# EAGLE design V-00735-00 (EAGLE 7.2.0)

## Sheet 1 of 2
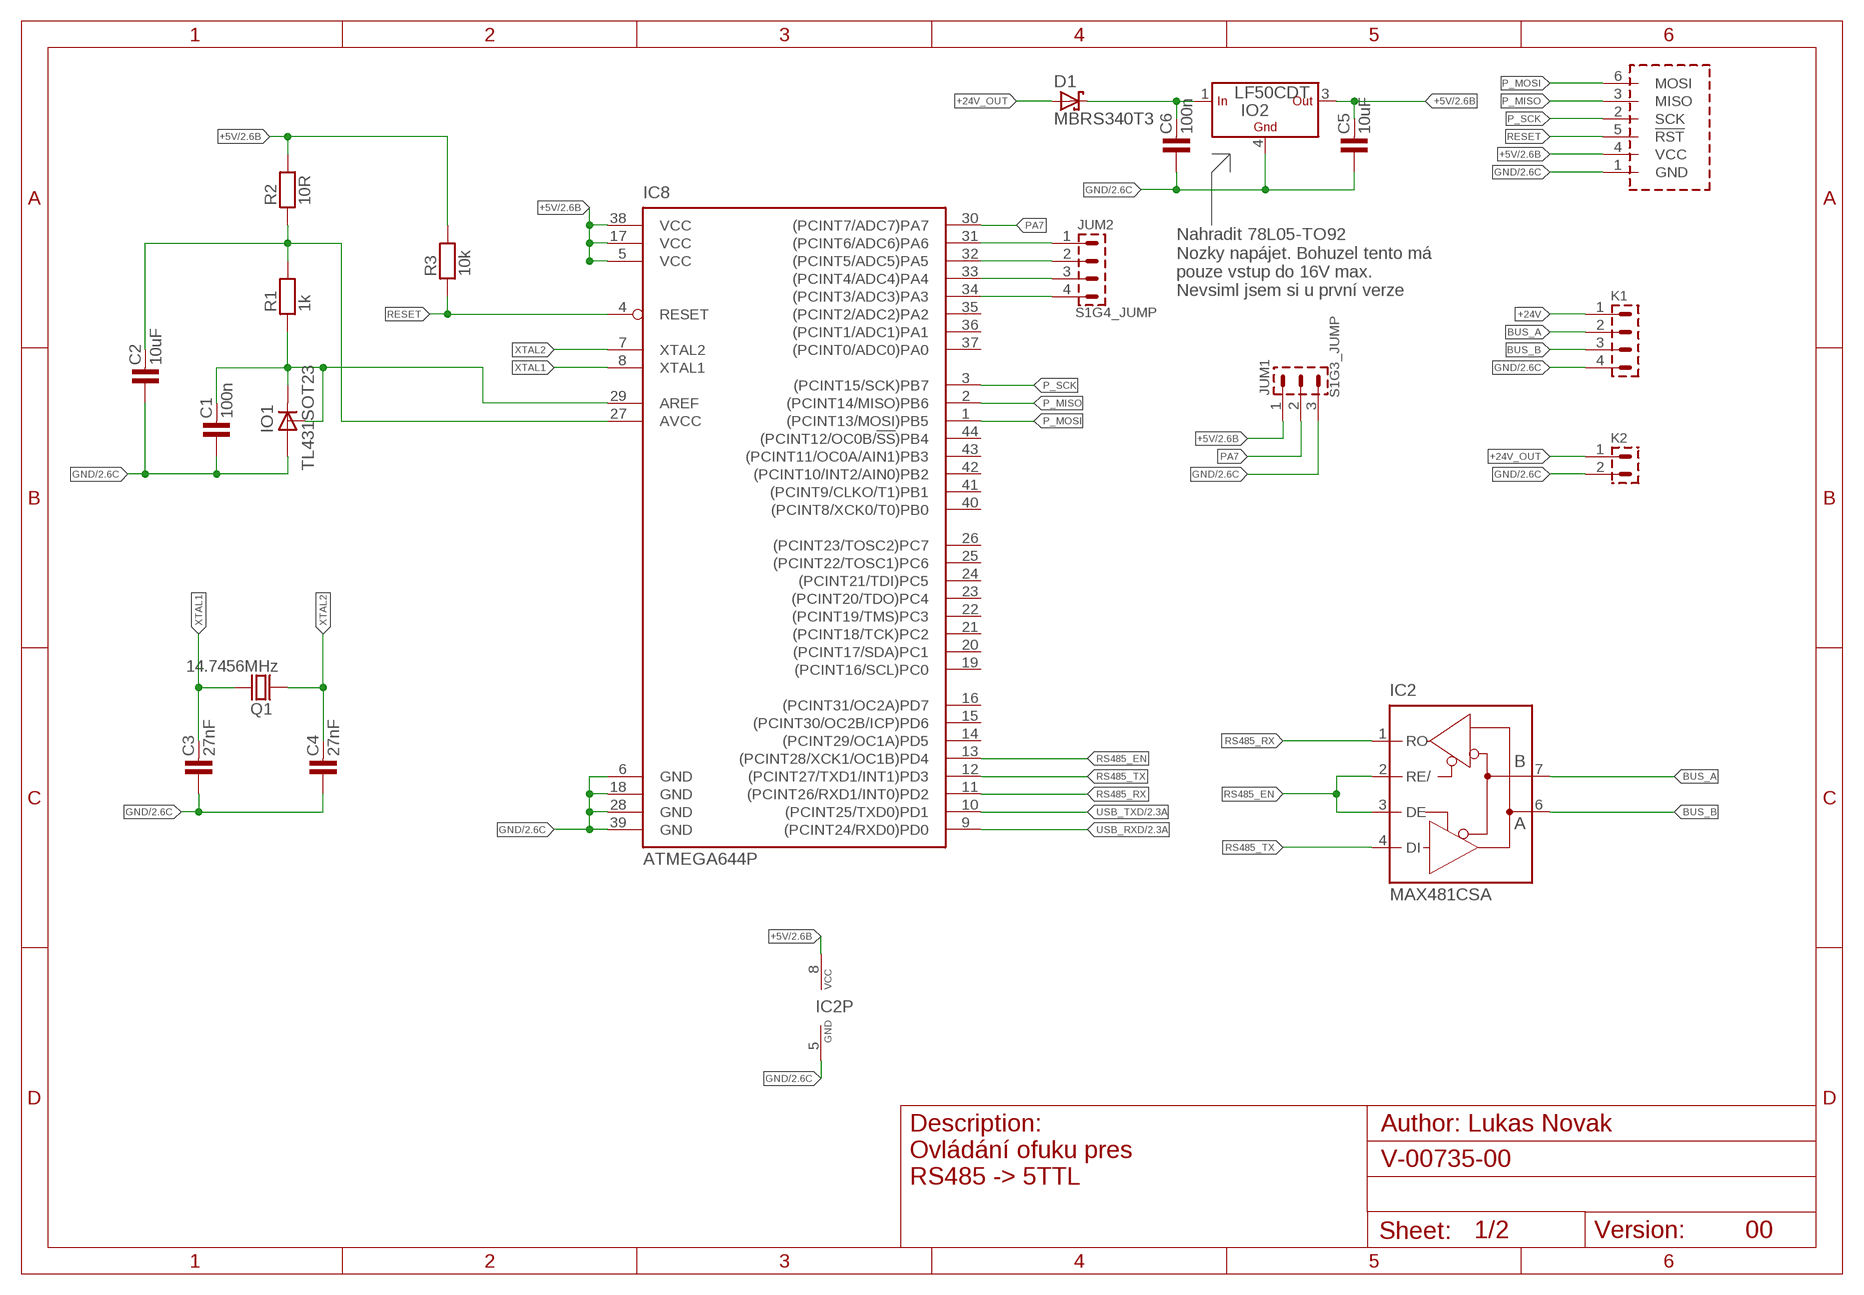
[diagram p0: schematic, sheet 1]

### Parts
C1  100n  C-KER_1206  [1206]
C2  10uF  C-KER_1206  [1206]
C3  27nF  C-KER_0805  [0805]
C4  27nF  C-KER_0805  [0805]
C5  10uF  C-KER_1206  [1206]
C6  100n  C-KER_1206  [1206]
D1  MBRS340T3  [SMC]
IC2  MAX481CSA  [SO08]
IC8  ATMEGA644P  [TQFP44]
IO1  TL431SOT23  [SOT23]
IO2  LF50CDT  LF_CDT  [DPAK]
JUM1  S1G3_JUMP  [S1G3_JUM]
JUM2  S1G4_JUMP  [S1G4_JUM]
K1  PSH02-04P  [PSH02-04P]
K2  PSH02-02P  [PSH02-02P]
Q1  14.7456MHz  Q_HC-49U  [HC-49U]
R1  1k  R_1206  [1206]
R2  10R  R_1206  [1206]
R3  10k  R_1206  [1206]
U$1  AVR_PROG_SPI  [PSH02-06P]

### Nets
+5V: C5.2 IC2.8(VCC) IC8.5(VCC) IC8.17(VCC) IC8.38(VCC) IO2.3(OUT) JUM1.1 R2.2 R3.2 U$1.4(VCC) ; also sheet 2
+24V: C6.2 D1.C IO2.1(IN) K1.1
+24V_OUT: D1.A K2.1
AREF: C1.2 IC8.29(AREF) IO1.1(C) IO1.2(R) R1.1
AVCC: C2.2 IC8.27(AVCC) R1.2 R2.1
BUS_A: IC2.7(B) K1.2
BUS_B: IC2.6(A) K1.3
GND: C1.1 C2.1 C3.1 C4.1 C5.1 C6.1 IC2.5(GND) IC8.6(GND) IC8.18(GND) IC8.28(GND) IC8.39(GND) IO1.3(A) IO2.4(GND) JUM1.3 K1.4 K2.2 U$1.1(GND) ; also sheet 2
N$1: IC8.31((PCINT6/ADC6)PA6) JUM2.1
N$2: IC8.32((PCINT5/ADC5)PA5) JUM2.2
N$5: IC8.33((PCINT4/ADC4)PA4) JUM2.3
N$6: IC8.34((PCINT3/ADC3)PA3) JUM2.4
P_MISO: IC8.2((PCINT14/MISO)PB6) U$1.3(MISO)
P_MOSI: IC8.1((PCINT13/MOSI)PB5) U$1.6(MOSI)
P_SCK: IC8.3((PCINT15/SCK)PB7) U$1.2(SCK)
PA7: IC8.30((PCINT7/ADC7)PA7) JUM1.2
RESET: IC8.4(RESET) R3.1 U$1.5(!RST)
RS485_EN: IC2.2(RE/) IC2.3(DE) IC8.13((PCINT28/XCK1/OC1B)PD4)
RS485_RX: IC2.1(RO) IC8.11((PCINT26/RXD1/INT0)PD2)
RS485_TX: IC2.4(DI) IC8.12((PCINT27/TXD1/INT1)PD3)
USB_RXD: IC8.9((PCINT24/RXD0)PD0) ; also sheet 2
USB_TXD: IC8.10((PCINT25/TXD0)PD1) ; also sheet 2
XTAL1: C3.2 IC8.8(XTAL1) Q1.2
XTAL2: C4.2 IC8.7(XTAL2) Q1.1
Unconnected: IC8.14((PCINT29/OC1A)PD5) IC8.15((PCINT30/OC2B/ICP)PD6) IC8.16((PCINT31/OC2A)PD7) IC8.19((PCINT16/SCL)PC0) IC8.20((PCINT17/SDA)PC1) IC8.21((PCINT18/TCK)PC2) IC8.22((PCINT19/TMS)PC3) IC8.23((PCINT20/TDO)PC4) IC8.24((PCINT21/TDI)PC5) IC8.25((PCINT22/TOSC1)PC6) IC8.26((PCINT23/TOSC2)PC7) IC8.35((PCINT2/ADC2)PA2) IC8.36((PCINT1/ADC1)PA1) IC8.37((PCINT0/ADC0)PA0) IC8.40((PCINT8/XCK0/T0)PB0) IC8.41((PCINT9/CLKO/T1)PB1) IC8.42((PCINT10/INT2/AIN0)PB2) IC8.43((PCINT11/OC0A/AIN1)PB3) IC8.44((PCINT12/OC0B/!SS!)PB4)

### Notes on the sheet
- Nahradit 78L05-TO92
  Nozky napájet. Bohuzel tento má
  pouze vstup do 16V max.
  Nevsiml jsem si u první verze
- Ovládání ofuku pres
  RS485 -> 5TTL
- 00

## Sheet 2 of 2
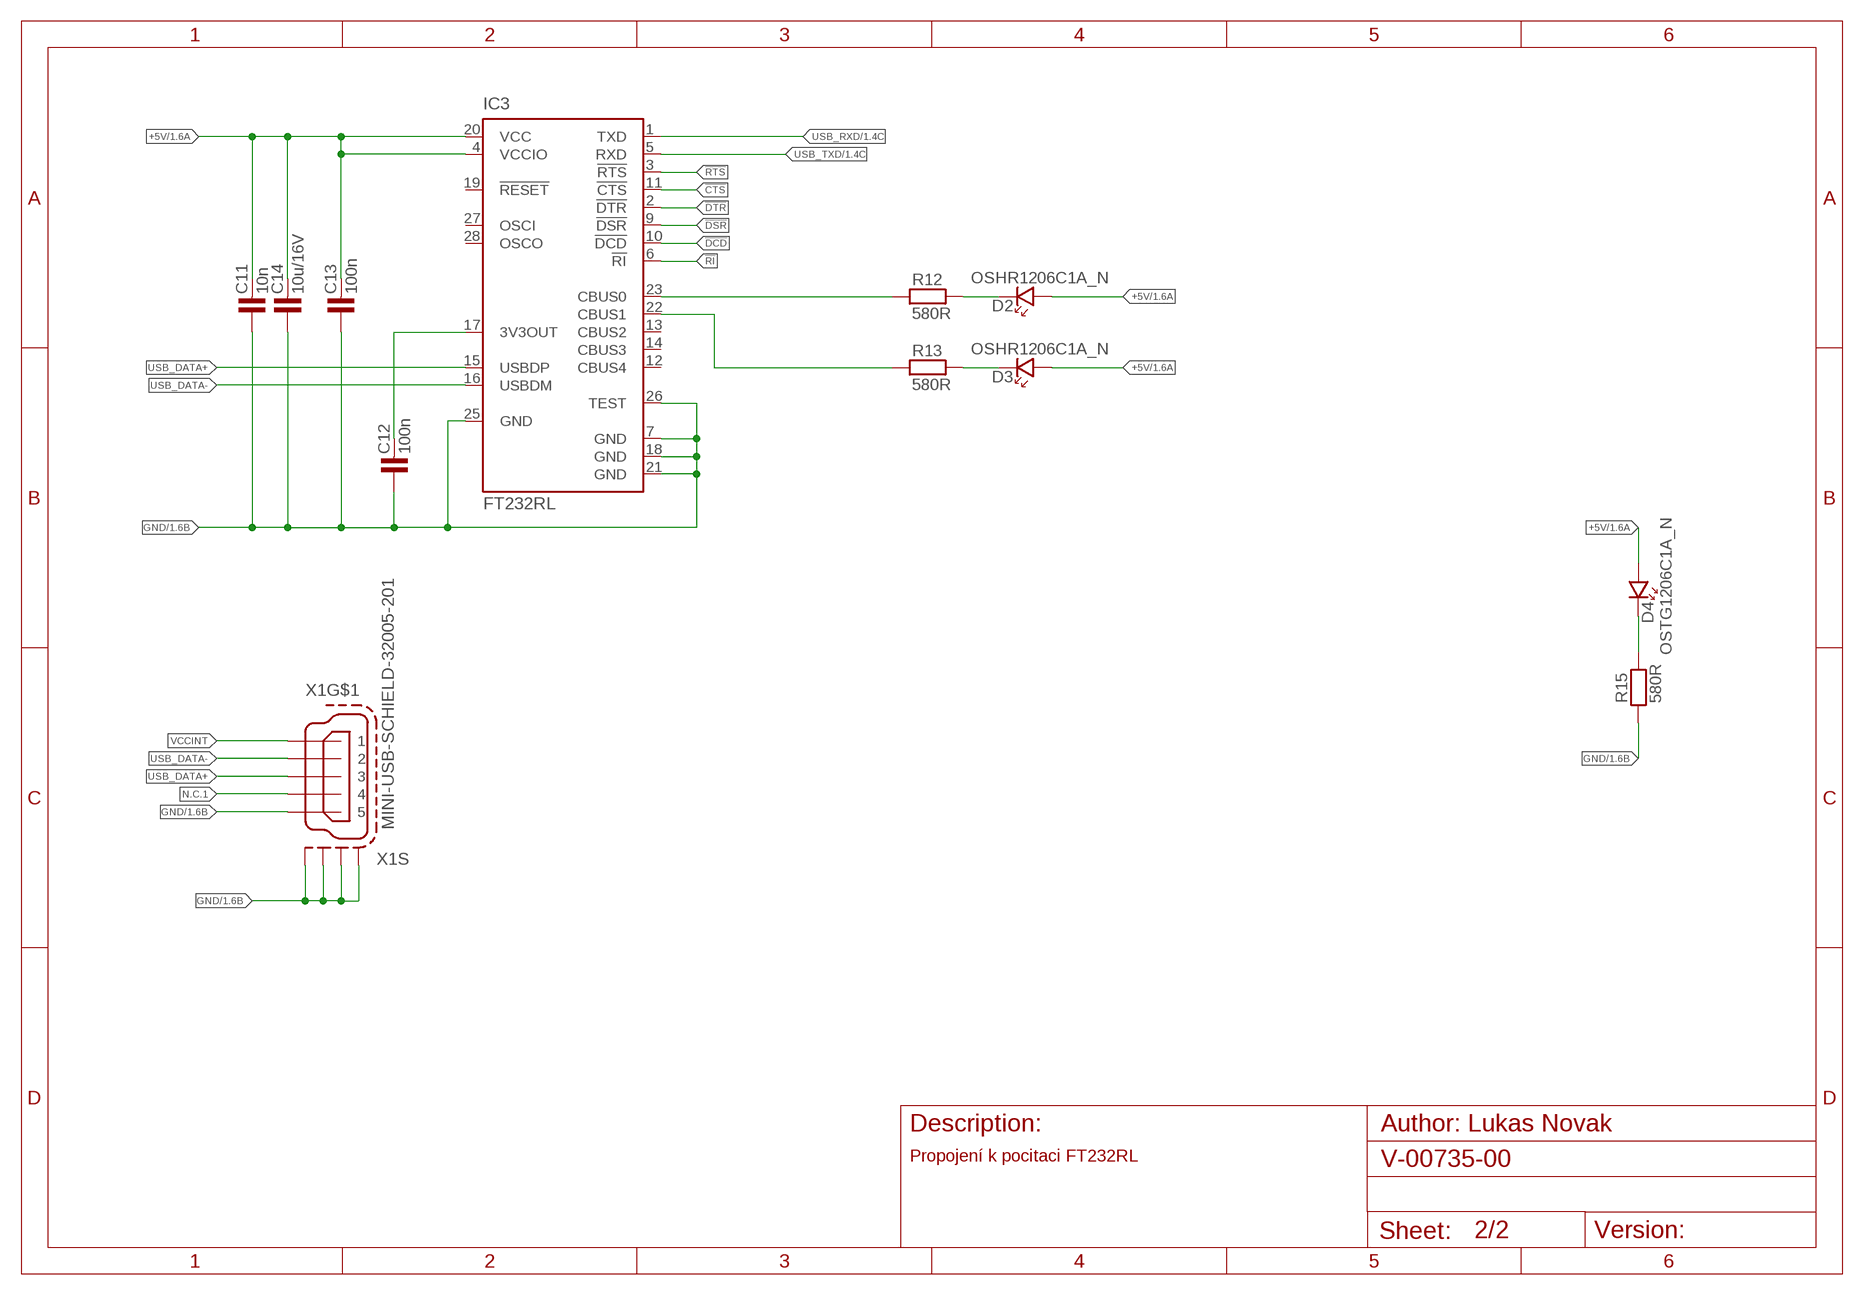
[diagram p1: schematic, sheet 2]

### Parts
C11  10n  C-KER_1206  [1206]
C12  100n  C-KER_1206  [1206]
C13  100n  C-KER_1206  [1206]
C14  10u/16V  C-KER_1206  [1206]
D2  OSHR1206C1A_N  LED_1206  [P1206]
D3  OSHR1206C1A_N  LED_1206  [P1206]
D4  OSTG1206C1A_N  LED_1206  [P1206]
IC3  FT232RL  [SSOP28]
R12  580R  R_1206  [1206]
R13  580R  R_1206  [1206]
R15  580R  R_1206  [1206]
X1  MINI-USB-SCHIELD-32005-201  [32005-201]

### Nets
!CTS: IC3.11(!CTS)
!DCD: IC3.10(!DCD)
!DSR: IC3.9(!DSR)
!DTR: IC3.2(!DTR)
!RI: IC3.6(!RI)
!RTS: IC3.3(!RTS)
+5V: C11.2 C13.2 C14.2 D2.A D3.A D4.A IC3.4(VCCIO) IC3.20(VCC) ; also sheet 1
GND: C11.1 C12.1 C13.1 C14.1 IC3.7(GND) IC3.18(GND) IC3.21(GND) IC3.25(GND) IC3.26(TEST) R15.1 X1.5 X1.M1(S:S1) X1.M2(S:S2) X1.M3(S:S3) X1.M4(S:S4) ; also sheet 1
N$28: IC3.23(CBUS0) R12.1
N$29: IC3.22(CBUS1) R13.1
N$30: C12.2 IC3.17(3V3OUT)
N$31: D2.K R12.2
N$32: D3.K R13.2
N$33: D4.K R15.2
N.C.1: X1.4
USB_DATA+: IC3.15(USBDP) X1.3
USB_DATA-: IC3.16(USBDM) X1.2
USB_RXD: IC3.1(TXD) ; also sheet 1
USB_TXD: IC3.5(RXD) ; also sheet 1
VCCINT: X1.1
Unconnected: IC3.12(CBUS4) IC3.13(CBUS2) IC3.14(CBUS3) IC3.19(!RESET) IC3.27(OSCI) IC3.28(OSCO)

### Notes on the sheet
- Propojení k pocitaci FT232RL

## Library data of the parts
C1-C6 C11-C14 = #PaJa_31:C-KER: Kondenzator - keramicky
D1 = diode:MBRS3*0T3: SCHOTTKY BARRIER RECTIFIER 3.0 AMPERES 20, 30, 40 VOLT Source: MBRS340T3-D.pdf
D2-D4 = #PaJa_31:LED: LED - jednobarevna
IC2 = maxim:MAX481CSA: RS485 TRANSEIVER; MF: MAXIM; MPN: MAX481CSA; OC_FARNELL: unknown; OC_NEWARK: 90C3817
IC3 = ftdichip:FT232R: Source: http://www.ftdichip.com/Documents/DataSheets/DS_FT232R_v104.pdf; MPN: FT232RL; OC_FARNELL: 1146032; OC_NEWARK: 91K9918
IC8 = atmel:ATMEGA644P
IO1 = references:TL431: Programmable Shunt Regulator TL431 Features > Programmable Output Voltage to 36 Volts > Low Dynamic Output Impedance 0.2? Typical > Sink Current Capability of 1.0 to 100mA > Equivalent Full-Range Temperature Coefficient of 50ppm/°C Typical > Temperature Compensated For Operation Over Full Rated Operating Temperature Range > Low Output Noise Voltage > Fast Turn-on Response; MPN: TL431BFDT; OC_FARNELL: 2095471; PACKAGE: SOT23; SUPPLIER: NXP
IO2 = #PaJa_31:LF_C: LF??C - stabilizatory low-drop Out= 1,5 / 1,8 / 2,5 / 3,3 / 4,7 / 5 / 6 / 8 / 5,5 / 9 / 12 V Avaiable in +- 1% (AB) , +- 2% (C)
JUM1 = #PaJa_konektory:S1G3_JUMP: Radove konektory - koliky - 3x
JUM2 = #PaJa_konektory:S1G4_JUMP: Radove konektory - koliky - 4x
K1 = #PaJa_konektory:PSH02-04: Konektory se zamkem - vidlice - 4pin
K2 = #PaJa_konektory:PSH02-02: Konektory se zamkem - vidlice - 2pin
Q1 = #PaJa_31:Q: Krystal HC-49 - 1MHz - 48MHz DT38 - Quartz (hodinovy) 32,768kHz
R1-R3 R12 R13 R15 = #PaJa_31:R: Rezistor
U$1 = #PaJa_konektory:AVR_PROG_SPI
X1 = con-cypressindustries:MINI-USB-SCHIELD-: MINI USB-B Conector Source: www.cypressindustries.com; OC_FARNELL: unknown; OC_NEWARK: unknown

## Net classes
0 default: width 0.305 mm, drill 0.3 mm, clearance 0.2 mm
2 Supply: width 0.305 mm, drill 0.3 mm, clearance 0.4 mm to class 0
3 Ground: width 0.305 mm, drill 0.3 mm, clearance 0.2 mm to class 0

## Board
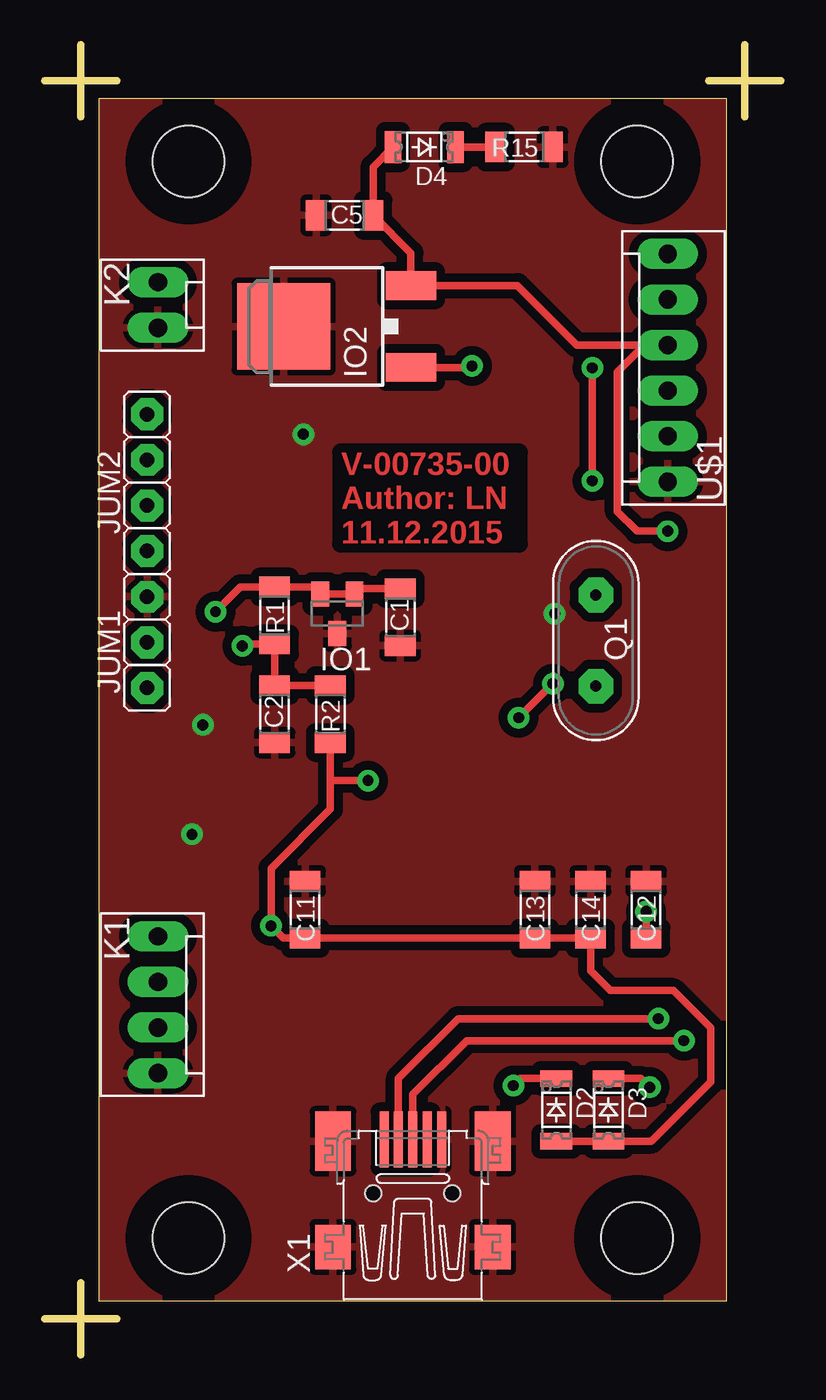
[diagram p2: board, top side]
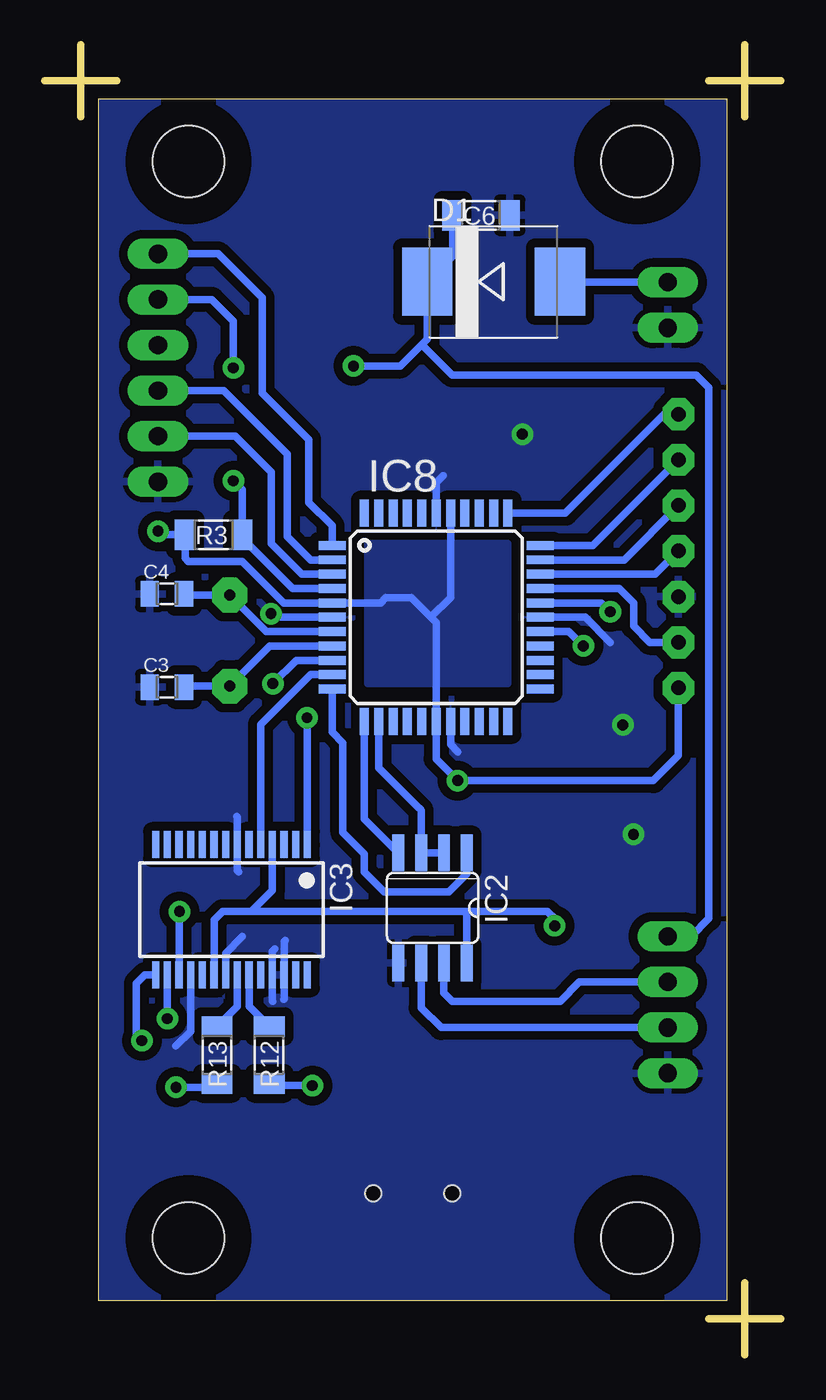
[diagram p3: board, bottom side, seen from below]

Size 41 x 73 mm. Coordinates in mm from the lower left corner, seen from the top.
Outline: 2,73 2,71
Outline: 2,71 2,69
Outline: 2,71 4,71
Outline: 2,71 0,71
Outline: 37,71 39,71
Outline: 39,71 41,71
Outline: 39,71 39,69
Outline: 39,71 39,73
Outline: 0,2 2,2
Outline: 2,2 4,2
Outline: 2,2 2,4
Outline: 2,2 2,0
Outline: 3,3 38,3 38,70 3,70 3,3
Copper layers (1*16): Top 0.04mm / dielectric 1.5mm / Bottom 0.04mm
Design rules "mucha_navrh *": minimum track width 0.2mm, minimum drill 0.6mm, track to track 0.5mm, track to pad 0.5mm, pad to pad 0.3mm, via to via 0.3mm, smd to smd 0mil, copper to edge 0.01mm, drill to drill 0.5mm, minimum pad ring 0.3mm, minimum via ring 0.3mm, stop-mask expansion 0.1mm, vias tented up to drill 0.8mm, thermal gap 0.3mm
Holes 4 mm at 8,6.5 33,6.5 8,66.5 33,66.5
tRestrict: area 29.5,3 to 36.5,10; area 4.5,3 to 11.5,10; area 4.5,63 to 11.5,70; area 29.5,63 to 36.5,70
bRestrict: area 4.5,3 to 11.5,10; area 29.5,3 to 36.5,10; area 4.5,63 to 11.5,70; area 29.5,63 to 36.5,70

### Footprints (pad centres in the part's own frame; a part is rotated, then mirrored left to right if it is on the bottom)
1206 = smd 1.143 x 1.702: 1 -1.587,0; 2 1.587,0
0805 = smd 1.016 x 1.422: 1 -0.953,0; 2 0.953,0
SMC = smd 2.8 x 3.8: A 3.7,0; C -3.7,0
P1206 = smd 0.914 x 1.778: A -1.905,0; K 1.587,0
SO08 = smd 0.66 x 2.032: 1 -1.905,-3.073; 2 -0.635,-3.073; 3 0.635,-3.073; 4 1.905,-3.073; 5 1.905,3.073; 6 0.635,3.073; 7 -0.635,3.073; 8 -1.905,3.073
SSOP28 = smd 0.4 x 1.5: 1 -4.225,-3.625; 2 -3.575,-3.625; 3 -2.925,-3.625; 4 -2.275,-3.625; 5 -1.625,-3.625; 6 -0.975,-3.625; 7 -0.325,-3.625; 8 0.325,-3.625; 9 0.975,-3.625; 10 1.625,-3.625; 11 2.275,-3.625; 12 2.925,-3.625; 13 3.575,-3.625; 14 4.225,-3.625; 15 4.225,3.625; 16 3.575,3.625; 17 2.925,3.625; 18 2.275,3.625; 19 1.625,3.625; 20 0.975,3.625; 21 0.325,3.625; 22 -0.325,3.625; 23 -0.975,3.625; 24 -1.625,3.625; 25 -2.275,3.625; 26 -2.925,3.625; 27 -3.575,3.625; 28 -4.225,3.625
TQFP44 = smd 1.5 x 0.5: 1 -5.8,4; 2 -5.8,3.2; 3 -5.8,2.4; 4 -5.8,1.6; 5 -5.8,0.8; 6 -5.8,0; 7 -5.8,-0.8; 8 -5.8,-1.6; 9 -5.8,-2.4; 10 -5.8,-3.2; 11 -5.8,-4; 23 5.8,-4; 24 5.8,-3.2; 25 5.8,-2.4; 26 5.8,-1.6; 27 5.8,-0.8; 28 5.8,0; 29 5.8,0.8; 30 5.8,1.6; 31 5.8,2.4; 32 5.8,3.2; 33 5.8,4 | smd 0.5 x 1.5: 12 -4,-5.8; 13 -3.2,-5.8; 14 -2.4,-5.8; 15 -1.6,-5.8; 16 -0.8,-5.8; 17 0,-5.8; 18 0.8,-5.8; 19 1.6,-5.8; 20 2.4,-5.8; 21 3.2,-5.8; 22 4,-5.8; 34 4,5.8; 35 3.2,5.8; 36 2.4,5.8; 37 1.6,5.8; 38 0.8,5.8; 39 0,5.8; 40 -0.8,5.8; 41 -1.6,5.8; 42 -2.4,5.8; 43 -3.2,5.8; 44 -4,5.8
SOT23 = smd 1 x 1.4: 1 -0.95,-1.1; 2 0.95,-1.1; 3 0,1.1
DPAK = smd 1.6 x 2.8: 1 -2.28,-4.992; 3 2.28,-4.992 | smd 4.826 x 5.191: 4 0,2.096
S1G3_JUM = drill 0.813 pad 1.778 octagon: 1 -2.54,0; 2 0,0; 3 2.54,0
S1G4_JUM = drill 0.813 pad 1.778 octagon: 1 -3.81,0; 2 -1.27,0; 3 1.27,0; 4 3.81,0
PSH02-04P = drill 1.016 pad 1.422 long: 1 -3.81,0; 2 -1.27,0; 3 1.27,0; 4 3.81,0
PSH02-02P = drill 1.016 pad 1.422 long: 1 -1.27,0; 2 1.27,0
HC-49U = drill 0.61 pad 1.93 octagon: 1 -2.54,0; 2 2.54,0
PSH02-06P = drill 1.016 pad 1.422 long: 1 -6.35,0; 2 -3.81,0; 3 -1.27,0; 4 1.27,0; 5 3.81,0; 6 6.35,0
32005-201 = smd 3.1 x 0.5: 1 3,1.6; 2 3,0.8; 3 3,0; 4 3,-0.8; 5 3,-1.6 | smd 2.5 x 2: M1 -3,-4.45; M2 -3,4.45 | smd 3.3 x 2: M3 2.9,4.45; M4 2.9,-4.45 | hole 0.9: 0,2.2; 0,-2.2

### Placement (x,y rotation side)
C1  19.8,41.1 90 top
C2  12.8,35.7 90 top
C3  34.2,37.2 0 bottom
C4  34.2,42.4 0 bottom
C5  16.7,63.5 0 top
C6  16.7,63.5 180 bottom
C11  14.5,24.8 270 top
C12  33.5,24.8 270 top
C13  27.3,24.8 270 top
C14  30.4,24.8 270 top
D1  16,59.8 0 bottom
D2  28.5,13.8 90 top
D3  31.4,13.8 90 top
D4  21.3,67.3 0 top
IC2  19.4,24.9 180 bottom
IC3  30.6,24.8 180 bottom
IC8  19.2,41.1 0 bottom
IO1  16.3,41.3 180 top
IO2  15.4,57.3 90 top
JUM1  5.7,39.7 90 top
JUM2  5.7,48.6 90 top
K1  6.3,19.5 270 top
K2  6.3,58.5 270 top
Q1  30.7,39.8 270 top
R1  12.8,41.2 270 top
R2  15.9,35.7 270 top
R3  31.6,45.7 180 bottom
R12  28.5,16.7 270 bottom
R13  31.4,16.7 270 bottom
R15  26.7,67.3 180 top
U$1  34.7,55 90 top
X1  20.5,9 90 top

### Tracks (layer width: path | path; a pad name or v marks a point on that pad's centre or on a via)
+5V  (via drill 0.6)
  Top 0.406: U$1.4 33.4,56.27 | 33.4,56.27 29.63,56.27 26.32,59.58 IO2.3 20.39,61.4 C5.2 18.29,66.19 D4.A | v34.7,45.9 33,45.9 31.9,47 31.9,54.77 33.4,56.27 | C13.2 C14.2 | C11.2 14.1,23.21 | C14.2 C11.2 | R2.2 15.9,31.9 | 15.9,31.9 15.9,30.4 12.6,27.1 v12.6,23.9 13.29,23.21 C11.2 | v18,32 16,32 15.9,31.9 | D2.A D3.A 33.8,11.89 37.1,15.2 37.1,18.2 35,20.3 31.5,20.3 30.4,21.4 C14.2
  Bottom 0.406: v34.7,45.9 34.5,45.7 R3.2 33.19,44.39 33,44.2 30,44.2 27.7,41.9 IC8.5 22.3,41.9 22,42.2 20.6,42.2 19.5,41.1 | IC3.20 31.57,24.23 31.1,24.7 29.5,24.7 | 29.5,24.7 17.4,24.7 | 17.4,24.7 13,24.7 12.6,24.3 v12.6,23.9 | IC2.8 17.49,24.61 17.4,24.7 | 19.5,41.1 19.2,40.8 IC8.17 19.2,33.2 v18,32 7.1,32 5.7,33.4 JUM1.1 | IC8.38 18.4,42.2 19.5,41.1 | IC3.4 28.32,25.88 29.5,24.7
  pour Bottom (rank 5): 15.2,45.2 23,45.2 23,37.4 15.2,37.4
+24V  (via drill 0.6)
  Top 0.406: IO2.1 23.72,55.02 v23.8,55.1
  Bottom 0.406: C6.2 18.29,61.21 D1.C 19.7,56.6 20,56.3 | v23.8,55.1 21.2,55.1 20,56.3 | K1.1 4.99,23.31 4,24.3 4,53.9 4.7,54.6 18.3,54.6 20,56.3
+24V_OUT
  Bottom 0.406: K2.1 12.27,59.77 D1.A
AREF  (via drill 0.6)
  Top 0.406: v9.5,41.4 10.89,42.79 R1.1 14.96,42.79 IO1.2 IO1.1 17.54,42.69 C1.2
  Bottom 0.406: IC8.29 10,41.9 v9.5,41.4
AVCC  (via drill 0.6)
  Top 0.406: v11,39.5 11.11,39.61 R1.2 C2.2 R2.1
  Bottom 0.406: IC8.27 11.8,40.3 v11,39.5
BUS_A
  Bottom 0.406: IC2.7 18.77,20.16 18.3,19.7 12.3,19.7 11.23,20.77 K1.2
BUS_B
  Bottom 0.406: IC2.6 20.04,19.34 18.93,18.23 K1.3
GND  (via drill 0.6)
  Top 0.406: 13.23,57.23 IO2.4
  Bottom 0.406: IC8.28 10.9,41.1 9.5,39.7 | 18,33.6 18.4,34 IC8.18 | IC3.21 30.93,22.38 30,23.3 | 28.2,22.6 28.32,22.48 IC3.25 28.32,19.73 28.3,19.7 | 27.6,23.1 27.68,23.02 IC3.26 27.68,19.82 27.7,19.8 | 30.2,26.9 30.27,26.98 IC3.7 30.27,29.98 30.3,30 | IC8.6 28.2,41.1 v28.4,41.3 | IC3.18 32.88,18.02 33.7,17.2 | IC8.39 19.2,48.6 18.8,49
  other vias: 8.8,35.1 8.2,29 14.4,51.3
  pour Bottom (rank 6): 3,3 38,3 38,70 3,70
  pour Top (rank 6): 3,3 38,3 38,70 3,70
N$1
  Bottom 0.406: IC8.31 6.99,43.5 JUM2.1
N$2
  Bottom 0.406: IC8.32 8.73,44.3 JUM2.2
N$5
  Bottom 0.406: IC8.33 10.47,45.1 JUM2.3
N$6
  Bottom 0.406: JUM2.4 6.49,52.41 12,46.9 IC8.34
N$28
  Bottom 0.406: IC3.23 29.62,19.41 R12.1
N$29
  Bottom 0.406: IC3.22 30.27,19.41 R13.1
N$30  (via drill 0.6)
  Top 0.406: v33.5,24.7 C12.2
  Bottom 0.406: IC3.17 33.52,24.68 v33.5,24.7
N$31  (via drill 0.6)
  Top 0.406: D2.K 26.49,15.39 v26.1,15
  Bottom 0.406: v26.1,15 28.39,15 R12.2
N$32  (via drill 0.6)
  Top 0.406: D3.K 33.21,15.39 v33.7,14.9
  Bottom 0.406: v33.7,14.9 31.61,14.9 R13.2
N$33
  Top 0.406: D4.K R15.2
P_MISO
  Bottom 0.406: IC8.2 26.2,44.3 27.35,45.45 27.5,45.6 27.5,50.2 31.03,53.73 U$1.3
P_MOSI
  Bottom 0.406: IC8.1 25,46.2 26.3,47.5 26.3,51 28.9,53.6 28.9,58.9 31.35,61.35 U$1.6
P_SCK
  Bottom 0.406: IC8.3 26.7,43.5 28.4,45.2 28.4,49.2 30.39,51.19 U$1.2
PA7
  Bottom 0.406: IC8.30 9,42.7 8.2,41.9 8.2,40.6 7.3,39.7 JUM1.2
RESET  (via drill 0.6)
  Top 0.406: v30.5,48.7 v30.5,55
  Bottom 0.406: IC8.4 27.2,42.7 30.01,45.51 R3.1 30.01,48.21 v30.5,48.7 | v30.5,55 30.5,57.6 31.7,58.8 U$1.5
RS485_EN
  Bottom 0.406: IC2.2 IC2.3 20.04,30.34 20.1,30.4 20.2,30.5 22.4,32.7 IC8.13
RS485_RX
  Bottom 0.406: IC8.11 25,34.7 24.4,34.1 24.4,29.1 23.2,27.9 23.2,26.9 22.1,25.8 18.5,25.8 17.49,26.8 IC2.1
RS485_TX
  Bottom 0.406: IC8.12 23.2,29.87 IC2.4
USB_DATA+  (via drill 0.6)
  Top 0.406: X1.3 20.5,14.5 23.5,17.5 v35.6,17.5
  Bottom 0.406: IC3.15 35.42,21.18 35.9,20.7 35.9,17.8 v35.6,17.5
USB_DATA-  (via drill 0.6)
  Top 0.406: X1.2 19.7,15.4 23.02,18.73 v34.17,18.73
  Bottom 0.406: IC3.16 v34.17,18.73
USB_RXD  (via drill 0.6)
  Top 0.406: v28.3,37.4 v26.4,35.5
  Bottom 0.406: IC8.9 27,38.7 v28.3,37.4 | IC3.1 26.38,35.48 v26.4,35.5
USB_TXD
  Bottom 0.406: IC8.10 26.2,37.9 28.98,35.12 IC3.5
XTAL1
  Bottom 0.406: IC8.8 28.46,39.5 Q1.2 33.19,37.26 C3.2
XTAL2
  Bottom 0.406: IC8.7 28.66,40.3 Q1.1 33.19,42.34 C4.2

### Text on the board
Top: V-00735-00 / Author: LN / 11.12.2015